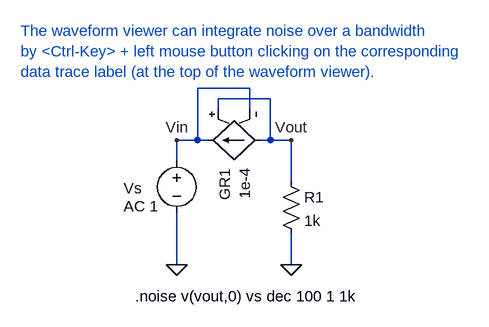
[diagram p0: schematic Ex8_11.asc]
Ex8_11.asc, the LTspice schematic file:
Version 4
SHEET 1 1072 704
WIRE 416 224 416 192
WIRE 416 384 416 304
WIRE 448 192 416 192
WIRE 448 192 448 112
WIRE 464 192 448 192
WIRE 480 144 480 128
WIRE 528 112 448 112
WIRE 528 144 528 112
WIRE 560 128 480 128
WIRE 560 192 544 192
WIRE 560 192 560 128
WIRE 592 192 560 192
WIRE 592 256 592 192
WIRE 592 384 592 336
FLAG 592 384 0
FLAG 416 384 0
FLAG 592 192 Vout
FLAG 416 192 Vin
SYMBOL res 576 240 R0
SYMATTR InstName R1
SYMATTR Value 1k
SYMBOL voltage 416 208 R0
WINDOW 0 -82 58 Left 0
WINDOW 3 24 104 Invisible 0
WINDOW 123 -82 86 Left 0
WINDOW 39 0 0 Left 0
SYMATTR InstName Vs
SYMATTR Value 0
SYMATTR Value2 AC 1
SYMBOL g 448 192 M90
WINDOW 0 43 42 Left 0
WINDOW 3 42 73 Left 0
SYMATTR InstName GR1
SYMATTR Value 1e-4
TEXT 352 432 Left 0 !.noise v(vout,0) vs dec 100 1 1k
TEXT 176 24 Left 0 ;The waveform viewer can integrate noise over a bandwidth \nby <Ctrl-Key> + left mouse button clicking on the corresponding \ndata trace label (at the top of the waveform viewer).

The netlist it stands for:
* Ex8_11.asc
R1 Vout 0 1k
Vs Vin 0 0 AC 1
GR1 Vout Vin Vout Vin 1e-4
.noise v(vout,0) vs dec 100 1 1k
* The waveform viewer can integrate noise over a bandwidth
* by <Ctrl-Key> + left mouse button clicking on the corresponding
* data trace label (at the top of the waveform viewer).
.backanno
.end